# Altium schematic sheet Bypass_FPGA_2V5.SchDoc: FPGA Bypass 2V5
size A4; Organization: Altium Limited.; Address1: Level 3, 12a Rodborough Rd; Address2: Frenchs Forest 2086; Address3: NSW; Address4: AUSTRALIA; DocumentNumber: 6; SheetNumber: 6; SheetTotal: 23; PageSetup: Record=PageOptions|CenterHorizontal=True|CenterVertical=True|PrintScale=0.97|XCorrection=1.00|YCorrection=1.00|PrintKind=0|BorderSize=5000000|LeftOffset=0|BottomOffset=0|Orientation=2|PaperLength=1000|PaperWidth=1000|Scale=100|PaperSource=7|PrintQuality=-4|MediaType=1|DitherType=10|PaperKind=A4 (210 x 297 mm)|PrintScaleMode=1
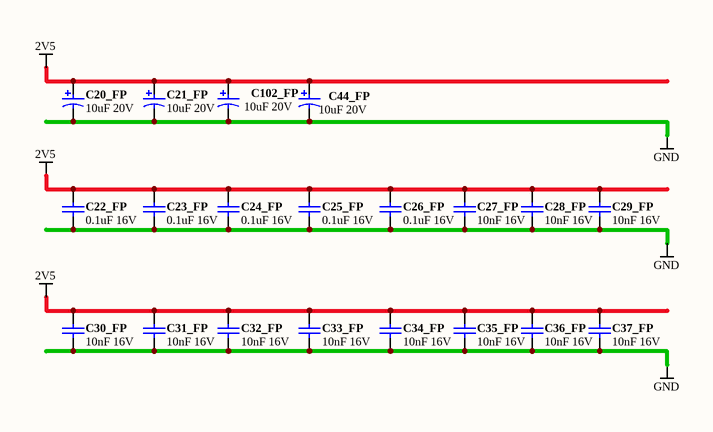
[diagram p0: Bypass_FPGA_2V5.SchDoc]

## Parts
C20_FP  10uF 20V  [CAPC3528-STAR]
C21_FP  10uF 20V  [CAPC3528-STAR]
C22_FP  0.1uF 16V  [CAPC1005-STAR]
C23_FP  0.1uF 16V  [CAPC1005-STAR]
C24_FP  0.1uF 16V  [CAPC1005-STAR]
C25_FP  0.1uF 16V  [CAPC1005-STAR]
C26_FP  0.1uF 16V  [CAPC1005-STAR]
C27_FP  10nF 16V  [CAPC1005-STAR]
C28_FP  10nF 16V  [CAPC1005-STAR]
C29_FP  10nF 16V  [CAPC1005-STAR]
C30_FP  10nF 16V  [CAPC1005-STAR]
C31_FP  10nF 16V  [CAPC1005-STAR]
C32_FP  10nF 16V  [CAPC1005-STAR]
C33_FP  10nF 16V  [CAPC1005-STAR]
C34_FP  10nF 16V  [CAPC1005-STAR]
C35_FP  10nF 16V  [CAPC1005-STAR]
C36_FP  10nF 16V  [CAPC1005-STAR]
C37_FP  10nF 16V  [CAPC1005-STAR]
C44_FP  10uF 20V  [CAPC3528-STAR]
C102_FP  10uF 20V  [CAPC3528-STAR]

## Nets
2V5: C20_FP.1 C21_FP.1 C22_FP.1 C23_FP.1 C24_FP.1 C25_FP.1 C26_FP.1 C27_FP.1 C28_FP.1 C29_FP.1 C30_FP.1 C31_FP.1 C32_FP.1 C33_FP.1 C34_FP.1 C35_FP.1 C36_FP.1 C37_FP.1 C44_FP.1 C102_FP.1
GND: C20_FP.2 C21_FP.2 C22_FP.2 C23_FP.2 C24_FP.2 C25_FP.2 C26_FP.2 C27_FP.2 C28_FP.2 C29_FP.2 C30_FP.2 C31_FP.2 C32_FP.2 C33_FP.2 C34_FP.2 C35_FP.2 C36_FP.2 C37_FP.2 C44_FP.2 C102_FP.2

## Notes on the sheet
- Sheet Title
- Project Title
- Size:
- Date:
- A4
- Assy:
- Time:
- Revision:
- Sheet
- of
- File:

## Library data of the parts
C20_FP C21_FP C44_FP C102_FP = D-101-0007: Capacitor, Tantalum, 10uF 10% 20V MCCT-B (3528); Polarity: Polarized; Category: Capacitor; Capacitance: 10 uF; Mounting Technology: Surface Mount; Rated Voltage: 20 V; Status: Production; Technology: Tantalum; Tolerance: 10 %
C22_FP C23_FP C24_FP C25_FP C26_FP = D-101-0080: Capacitor, Ceramic, 0.1uF 10% 16V 0402 (1005) X7R; Polarity: Non-Polarized; Category: Capacitor; Capacitance: 0.1 uF; Dielectric: X7R; Mounting Technology: Surface Mount; Rated Voltage: 16 V; Status: Production; Technology: Ceramic; Tolerance: 10 %
C27_FP C28_FP C29_FP C30_FP C31_FP C32_FP C33_FP C34_FP C35_FP C36_FP C37_FP = D-101-0077: Capacitor, Ceramic, 10nF 10% 16V 0402 (1005) X7R; Polarity: Non-Polarized; Category: Capacitor; Capacitance: 10 nF; Dielectric: X7R; Mounting Technology: Surface Mount; Rated Voltage: 16 V; Status: Production; Technology: Ceramic; Tolerance: 10 %